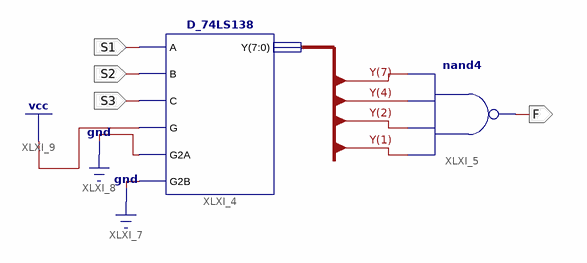
[diagram p0: schematic sheet 1]
// Xilinx ISE schematic LampCtrl138.sch (kintex7) as structural Verilog: 2 symbols, 4 ports
module LampCtrl138 (
  input  S1,
  input  S2,
  input  S3,
  output F
);

  wire [7:0] Y;

  D_74LS138 XLXI_4 (.A(S1), .B(S2), .C(S3), .G(1'b1), .G2A(1'b0), .G2B(1'b0), .Y(Y));
  nand XLXI_5 (F, Y[1], Y[2], Y[4], Y[7]);
endmodule
